# Altium schematic sheet 05-VIDEO_IN_ADC_1.SchDoc
size B
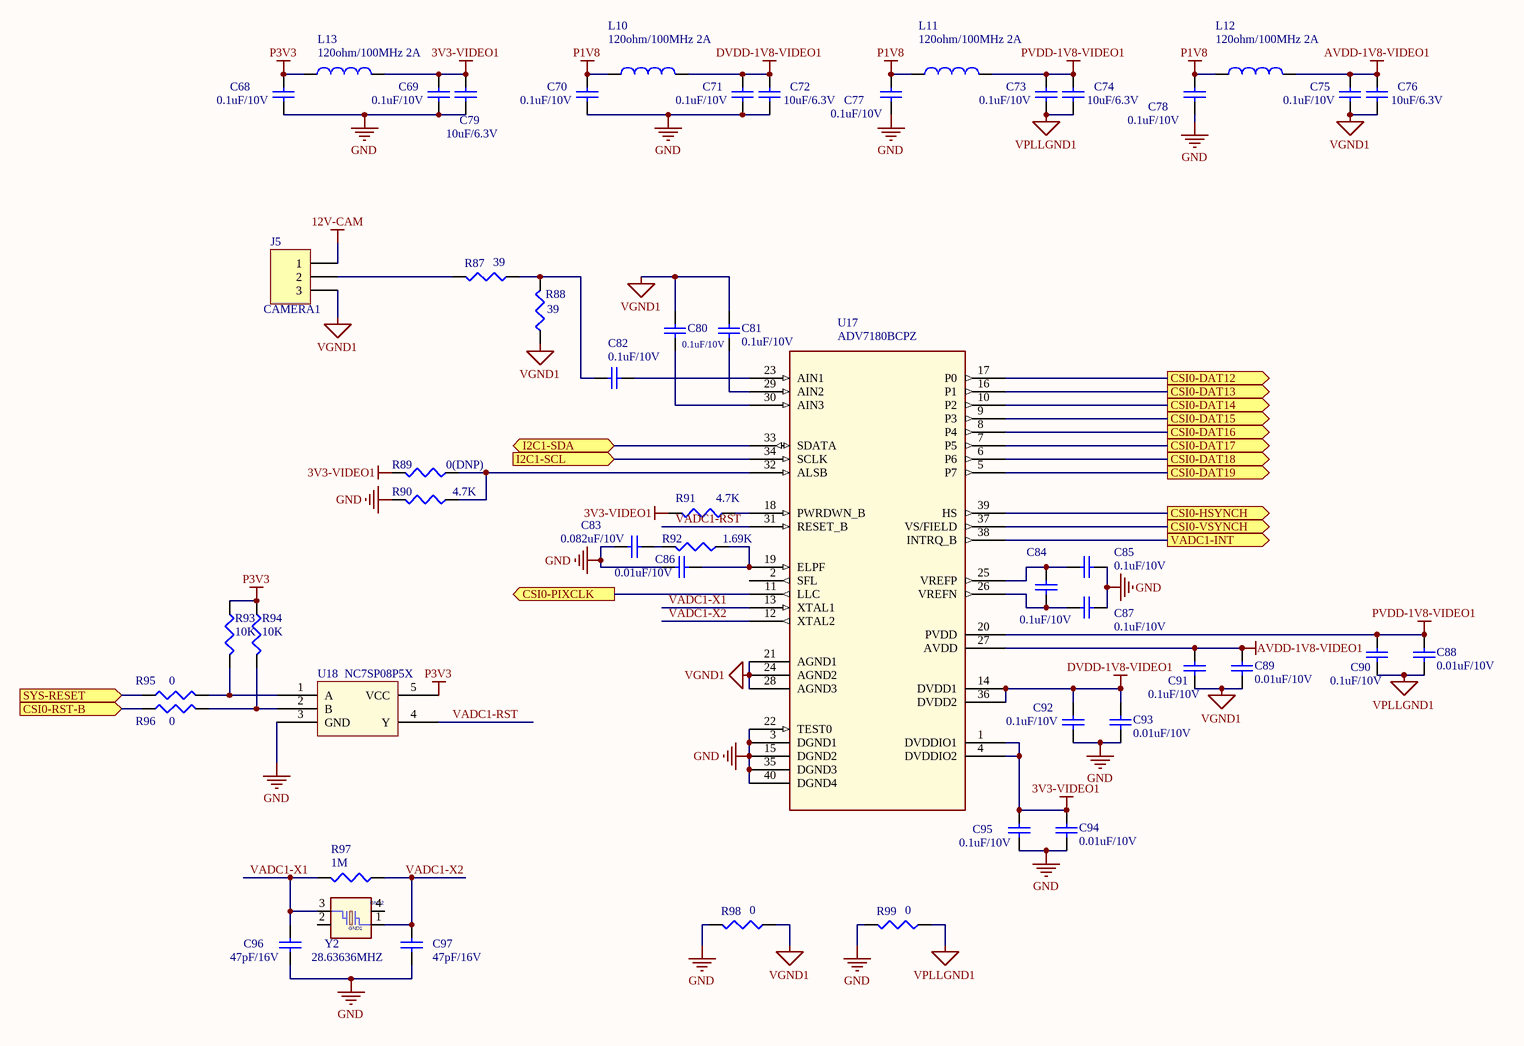
[diagram p0: 05-VIDEO_IN_ADC_1.SchDoc]

## Parts
C68  0.1uF/10V  [0402]
C69  0.1uF/10V  [0402]
C70  0.1uF/10V  [0402]
C71  0.1uF/10V  [0402]
C72  10uF/6.3V  [0805]
C73  0.1uF/10V  [0402]
C74  10uF/6.3V  [0805]
C75  0.1uF/10V  [0402]
C76  10uF/6.3V  [0805]
C77  0.1uF/10V  [0402]
C78  0.1uF/10V  [0402]
C79  10uF/6.3V  [0805]
C80  0.1uF/10V  [0402]
C81  0.1uF/10V  [0402]
C82  0.1uF/10V  [0402]
C83  0.082uF/10V  [0402]
C84  0.1uF/10V  [0402]
C85  0.1uF/10V  [0402]
C86  0.01uF/10V  [0402]
C87  0.1uF/10V  [0402]
C88  0.01uF/10V  [0402]
C89  0.01uF/10V  [0402]
C90  0.1uF/10V  [0402]
C91  0.1uF/10V  [0402]
C92  0.1uF/10V  [0402]
C93  0.01uF/10V  [0402]
C94  0.01uF/10V  [0402]
C95  0.1uF/10V  [0402]
C96  47pF/16V  [0402]
C97  47pF/16V  [0402]
J5  CAMERA1  [CONN-3P]
L10  120ohm/100MHz 2A  [0603]
L11  120ohm/100MHz 2A  [0603]
L12  120ohm/100MHz 2A  [0603]
L13  120ohm/100MHz 2A  [0603]
R87  39  [0402]
R88  39  [0402]
R89  0(DNP)  [0402]
R90  4.7K  [0402]
R91  4.7K  [0402]
R92  1.69K  [0402]
R93  10K  [0402]
R94  10K  [0402]
R95  0  [0402]
R96  0  [0402]
R97  1M  [0402]
R98  0  [0402]
R99  0  [0402]
U17  ADV7180BCPZ  [LFCSP40]
U18  NC7SP08P5X  [SC70]
Y2  28.63636MHZ  [XTAL4_SX_3225]

## Ports
CSI0-DAT12 (out), CSI0-DAT13 (out), CSI0-DAT14 (out), CSI0-DAT15 (out), CSI0-DAT16 (out), CSI0-DAT17 (out), CSI0-DAT18 (out), CSI0-DAT19 (out), CSI0-HSYNCH (out), CSI0-PIXCLK (out), CSI0-RST-B (in), CSI0-VSYNCH (out), I2C1-SCL (in), I2C1-SDA (bidir), SYS-RESET (in), VADC1-INT (out)

## Nets
3V3-VIDEO1: C69.1 C79.1 C94.2 C95.2 L13.2 R89.2 R91.2 U17.1(DVDDIO1) U17.4(DVDDIO2)
12V-CAM: J5.1
AVDD-1V8-VIDEO1: C75.1 C76.1 C89.2 C91.2 L12.2 U17.27(AVDD)
DVDD-1V8-VIDEO1: C71.1 C72.1 C92.2 C93.2 L10.2 U17.14(DVDD1) U17.36(DVDD2)
GND: C68.2 C69.2 C70.2 C71.2 C72.2 C77.2 C78.2 C79.2 C83.1 C85.1 C86.1 C87.2 C92.1 C93.1 C94.1 C95.1 C96.1 C97.1 R90.2 R98.2 R99.2 U17.3(DGND1) U17.15(DGND2) U17.22(TEST0) U17.35(DGND3) U17.40(DGND4) U18.3(GND)
P1V8: C70.1 C77.1 C78.1 L10.1 L11.1 L12.1
P3V3: C68.1 L13.1 R93.1 R94.1 U18.5(VCC)
PVDD-1V8-VIDEO1: C73.1 C74.1 C88.2 C90.2 L11.2 U17.20(PVDD)
VGND1: C75.2 C76.2 C80.2 C81.2 C89.1 C91.1 J5.3 R88.1 R98.1 U17.21(AGND1) U17.24(AGND2) U17.28(AGND3)
VPLLGND1: C73.2 C74.2 C88.1 C90.1 R99.1
CSI0-DAT12: U17.17(P0) ; port CSI0-DAT12
CSI0-DAT13: U17.16(P1) ; port CSI0-DAT13
CSI0-DAT14: U17.10(P2) ; port CSI0-DAT14
CSI0-DAT15: U17.9(P3) ; port CSI0-DAT15
CSI0-DAT16: U17.8(P4) ; port CSI0-DAT16
CSI0-DAT17: U17.7(P5) ; port CSI0-DAT17
CSI0-DAT18: U17.6(P6) ; port CSI0-DAT18
CSI0-DAT19: U17.5(P7) ; port CSI0-DAT19
CSI0-HSYNCH: U17.39(HS) ; port CSI0-HSYNCH
CSI0-PIXCLK: U17.11(LLC) ; port CSI0-PIXCLK
CSI0-RST-B: R96.1 ; port CSI0-RST-B
CSI0-VSYNCH: U17.37(VS/FIELD) ; port CSI0-VSYNCH
I2C1-SCL: U17.34(SCLK) ; port I2C1-SCL
I2C1-SDA: U17.33(SDATA) ; port I2C1-SDA
SYS-RESET: R95.1 ; port SYS-RESET
VADC1-INT: U17.38(INTRQ_B) ; port VADC1-INT
VADC1-RST: U17.31(RESET_B) U18.4(Y)
VADC1-X1: C96.2 R97.2 U17.13(XTAL1) Y2.3
VADC1-X2: C97.2 R97.1 U17.12(XTAL2) Y2.1
NetC80_1: C80.1 U17.30(AIN3)
NetC81_1: C81.1 U17.29(AIN2)
NetC82_1: C82.1 R87.1 R88.2
NetC82_2: C82.2 U17.23(AIN1)
NetC83_2: C83.2 R92.2
NetC84_1: C84.1 C87.1 U17.26(VREFN)
NetC84_2: C84.2 C85.2 U17.25(VREFP)
NetC86_2: C86.2 R92.1 U17.19(ELPF)
NetJ5_2: J5.2 R87.2
NetR89_1: R89.1 R90.1 U17.32(ALSB)
NetR91_1: R91.1 U17.18(PWRDWN_B)
NetR93_2: R93.2 R95.2 U18.1(A)
NetR94_2: R94.2 R96.2 U18.2(B)

Not connected (* = marked no-connect by the designer): U17 2(SFL); Y2 2(GND1) 4(GND2)

## Library data of the parts
C68-C97 = Cap: Capacitor; Published: 8-Jun-2000; LatestRevisionDate: 17-Jul-2002; LatestRevisionNote: Re-released for DXP Platform.; PackageReference: RAD-0.3; Publisher: Altium Limited; PackageDescription: Radial Cap, Thru-Hole; 2 Leads; 0.3 in Pin Spacing
J5 = Header 3: Header, 3-Pin; LatestRevisionDate: 17-Jul-2002; LatestRevisionNote: Re-released for DXP Platform.; Publisher: Altium Limited
L10-L13 = Inductor: Code_IEC: 1005; Value: 300ohm/100MHz BEAD; Published: 8-Jun-2000; LatestRevisionDate: 29-May-2009; LatestRevisionNote: IPC-7351 Footprint Added.; PackageReference: 0402-A; Publisher: Altium Limited; PackageDescription: Chip Inductor; Code_JEITA: 0402
R87-R99 = CR16-1003FM
U17 = ADV7180BCPZ: CLASS: IC
Y2 = CRYSTAL_JXS63: XTAL 28.63636MHZ 10PF RSN -- SMT; CLASS: IC; PRIORITY_PN: 048-00268; CAD_APPROVED: Yes; MFG_PN01: ABM3B-28.63636MHZ-10-1-U-T; MFG_NAME01: ABRACON CORP; AGILE_PN: 230-76635; HEIGHT: 1.1MM; ROHS: Yes